# EAGLE design Vale_Project_02 (EAGLE 9.6.2)
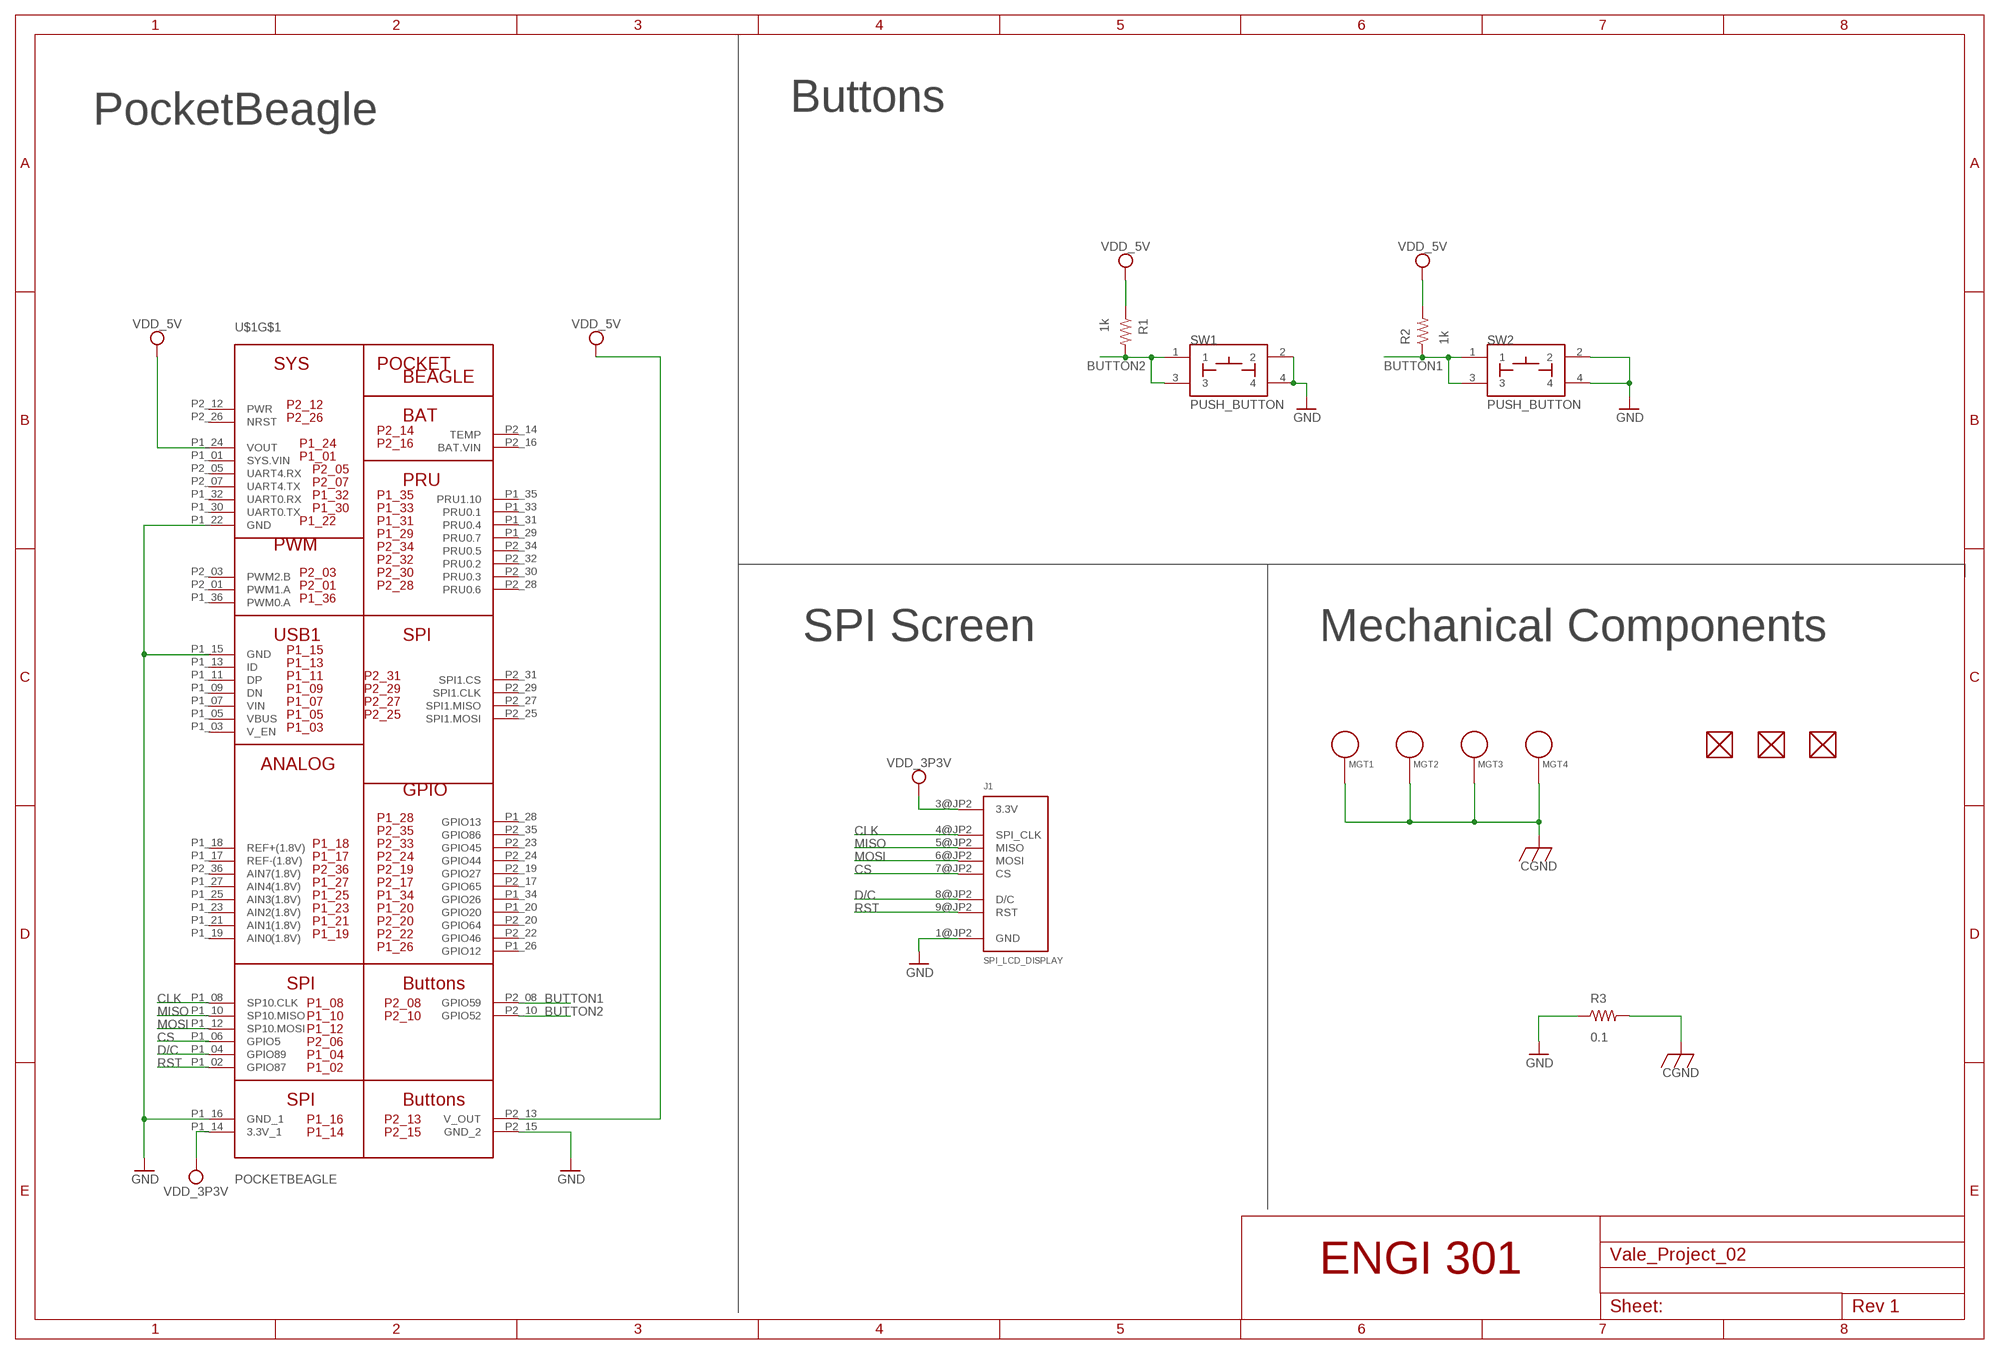
[diagram p0: schematic, sheet 1]

## Parts
FUD1  FIDUCIAL  [FIDUCIAL_40MIL]
FUD2  FIDUCIAL  [FIDUCIAL_40MIL]
FUD3  FIDUCIAL  [FIDUCIAL_40MIL]
J1  SPI_LCD_DISPLAY  [SPI_LCD_DISPLAY]
MGT1  MOUNTING_HOLE  [MOUNTING_HOLE]
MGT2  MOUNTING_HOLE  [MOUNTING_HOLE]
MGT3  MOUNTING_HOLE  [MOUNTING_HOLE]
MGT4  MOUNTING_HOLE  [MOUNTING_HOLE]
R1  1k  R_R1206  [R1206]
R2  1k  R_R1206  [R1206]
R3  0.1  R_R0805  [R0805]
SW1  PUSH_BUTTON  [BUTTON_12.5MM]
SW2  PUSH_BUTTON  [BUTTON_12.5MM]
U$1  POCKETBEAGLE  [POCKETBEAGLE]

## Nets
BUTTON1: R2.1 SW2.1 SW2.3 U$1.P2_08(GPIO59)
BUTTON2: R1.2 SW1.1 SW1.3 U$1.P2_10(GPIO52)
CGND: MGT1.P$1 MGT2.P$1 MGT3.P$1 MGT4.P$1 R3.2
CLK: J1.4@JP2(SPI_CLK) U$1.P1_08(SP10.CLK)
CS: J1.7@JP2(CS) U$1.P1_06(GPIO5)
D/C: J1.8@JP2(D/C) U$1.P1_04(GPIO89)
GND: J1.1@JP2(GND) R3.1 SW1.2 SW1.4 SW2.2 SW2.4 U$1.P1_15(GND) U$1.P1_16(GND_1) U$1.P1_22(GND) U$1.P2_15(GND_2)
MISO: J1.5@JP2(MISO) U$1.P1_10(SP10.MISO)
MOSI: J1.6@JP2(MOSI) U$1.P1_12(SP10.MOSI)
RST: J1.9@JP2(RST) U$1.P1_02(GPIO87)
VDD_3P3V: J1.3@JP2(3.3V) U$1.P1_14(3.3V_1)
VDD_5V: R1.1 R2.2 U$1.P1_24(VOUT) U$1.P2_13(V_OUT)
Unconnected: FUD1.P$1 FUD2.P$1 FUD3.P$1 U$1.P1_01(SYS.VIN) U$1.P1_03(V_EN) U$1.P1_05(VBUS) U$1.P1_07(VIN) U$1.P1_09(DN) U$1.P1_11(DP) U$1.P1_13(ID) U$1.P1_17(REF-(1.8V)) U$1.P1_18(REF+(1.8V)) U$1.P1_19(AIN0(1.8V)) U$1.P1_20(GPIO20) U$1.P1_21(AIN1(1.8V)) U$1.P1_23(AIN2(1.8V)) U$1.P1_25(AIN3(1.8V)) U$1.P1_26(GPIO12) U$1.P1_27(AIN4(1.8V)) U$1.P1_28(GPIO13) U$1.P1_29(PRU0.7) U$1.P1_30(UART0.TX) U$1.P1_31(PRU0.4) U$1.P1_32(UART0.RX) U$1.P1_33(PRU0.1) U$1.P1_34(GPIO26) U$1.P1_35(PRU1.10) U$1.P1_36(PWM0.A) U$1.P2_01(PWM1.A) U$1.P2_03(PWM2.B) U$1.P2_05(UART4.RX) U$1.P2_07(UART4.TX) U$1.P2_12(PWR) U$1.P2_14(TEMP) U$1.P2_16(BAT.VIN) U$1.P2_17(GPIO65) U$1.P2_19(GPIO27) U$1.P2_20(GPIO64) U$1.P2_22(GPIO46) U$1.P2_23(GPIO45) U$1.P2_24(GPIO44) U$1.P2_25(SPI1.MOSI) U$1.P2_26(NRST) U$1.P2_27(SPI1.MISO) U$1.P2_28(PRU0.6) U$1.P2_29(SPI1.CLK) U$1.P2_30(PRU0.3) U$1.P2_31(SPI1.CS) U$1.P2_32(PRU0.2) U$1.P2_34(PRU0.5) U$1.P2_35(GPIO86) U$1.P2_36(AIN7(1.8V))

## Notes on the sheet
- PocketBeagle | Buttons
- SPI Screen | Mechanical Components
- ENGI 301

## Library data of the parts
FUD1-FUD3 = Vale_Project_02:FIDUCIAL
J1 = Vale_Project_02:SPI_LCD_DISPLAY: 2.8" Adafruit SPI Display
MGT1-MGT4 = Vale_Project_02:MOUNTING_HOLE: Chassis Mounting Hole w/GND connection ability
R1-R3 = Vale_Project_02:R_: RESISTOR, American symbol
SW1 SW2 = Vale_Project_02:PUSH_BUTTON
U$1 = Vale_Project_02:POCKETBEAGLE

## Board
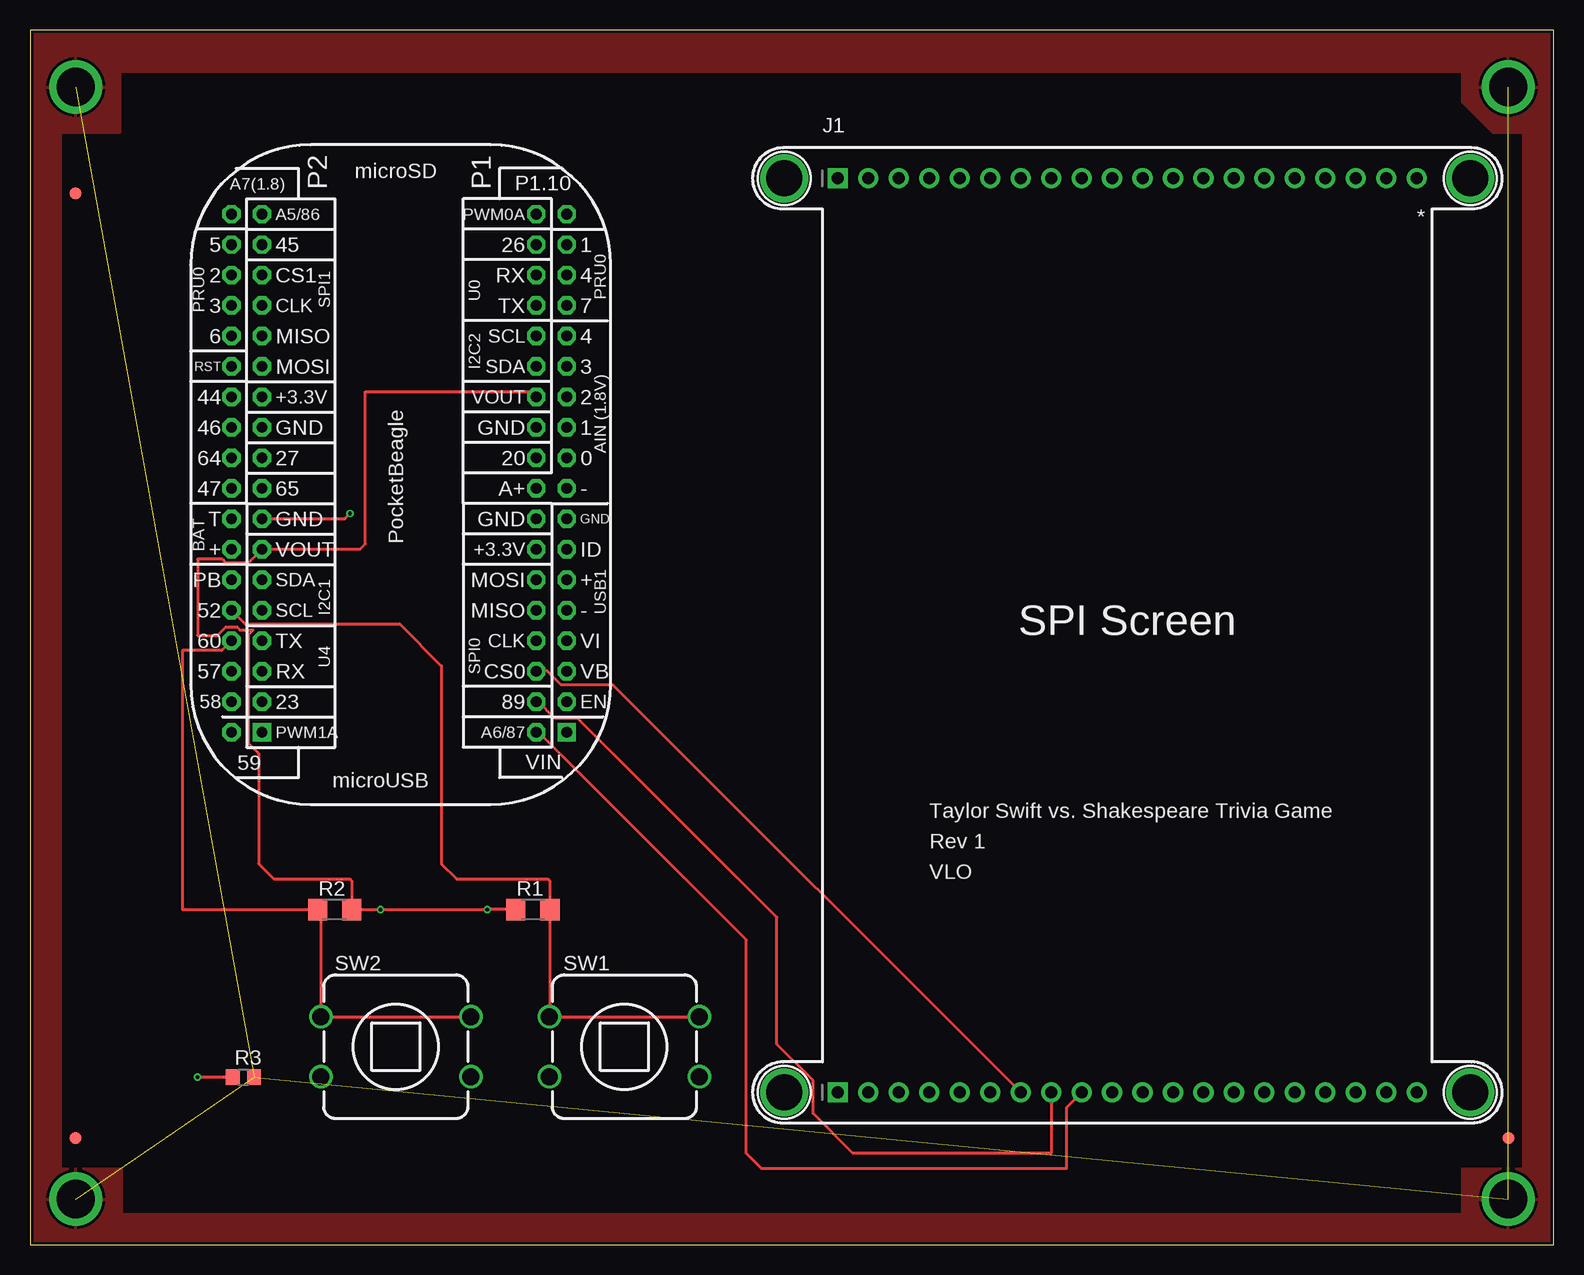
[diagram p1: board, top side]
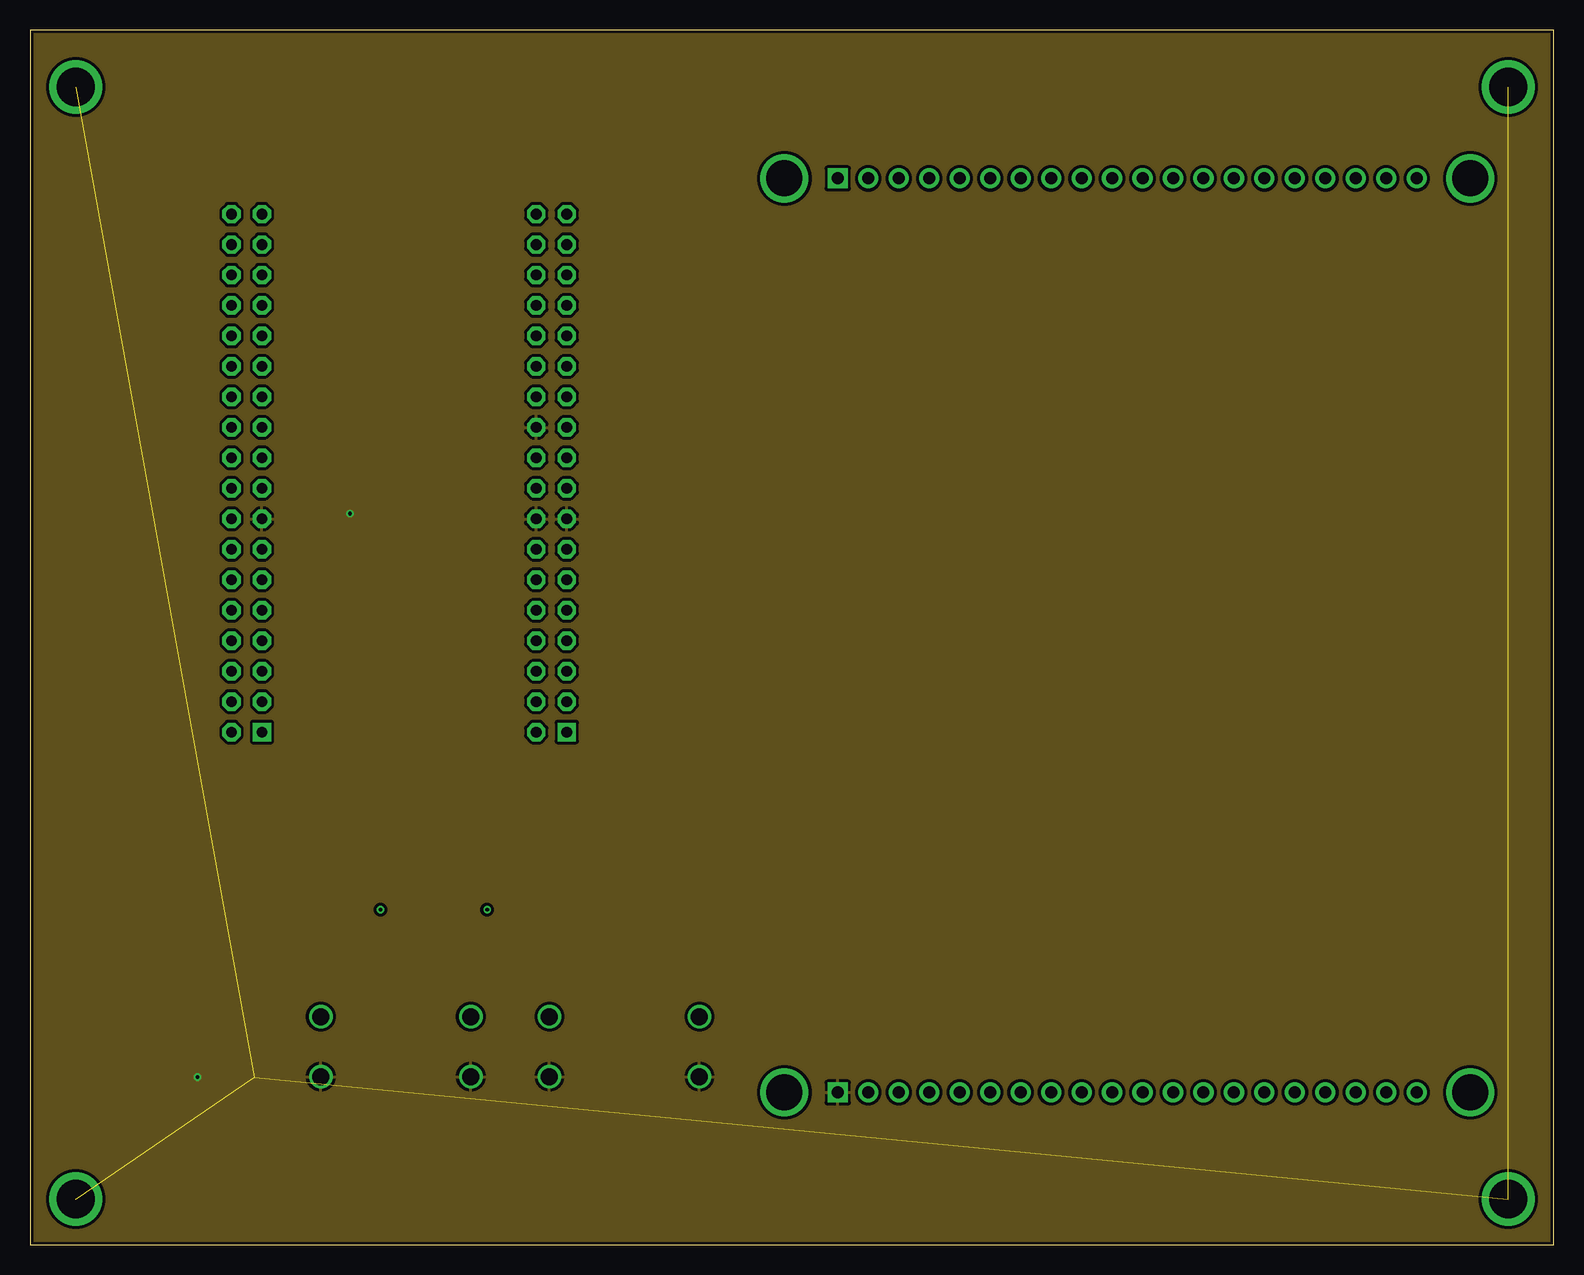
[diagram p2: board, inner layer Route2]
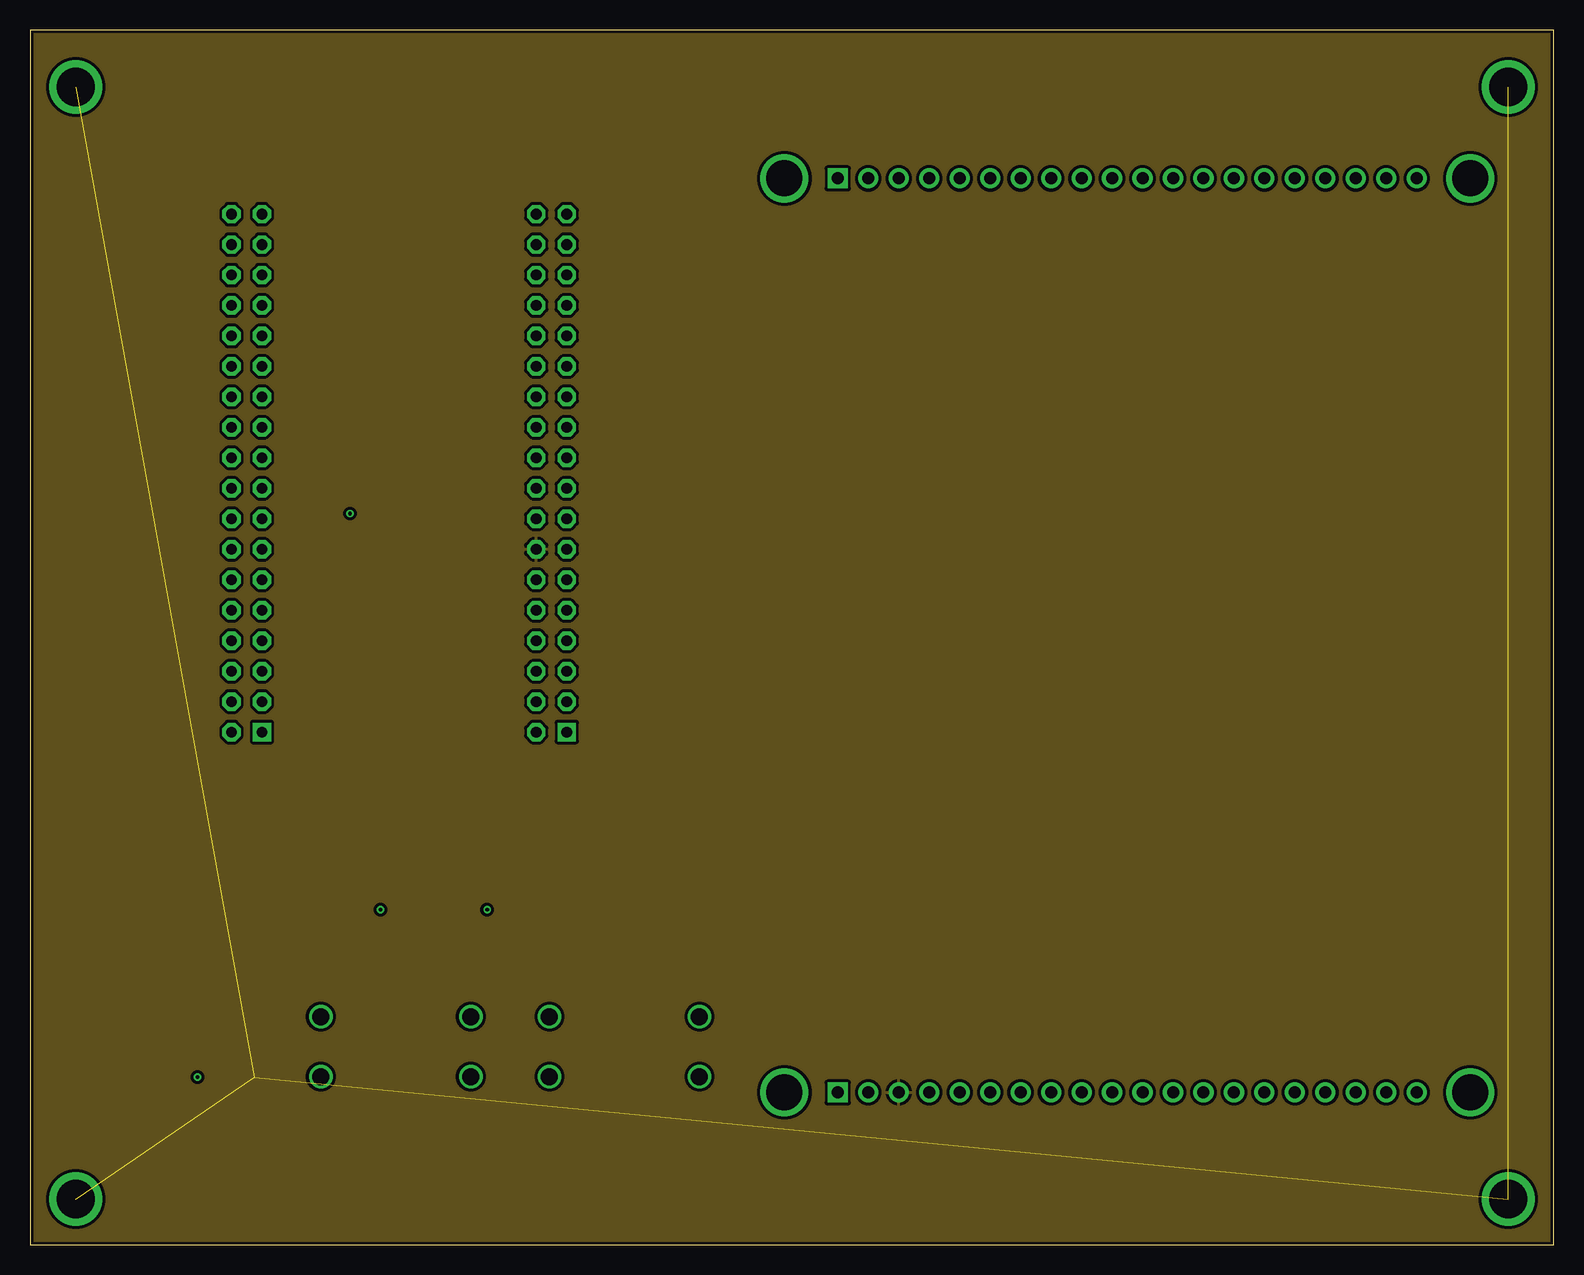
[diagram p3: board, inner layer Route15]
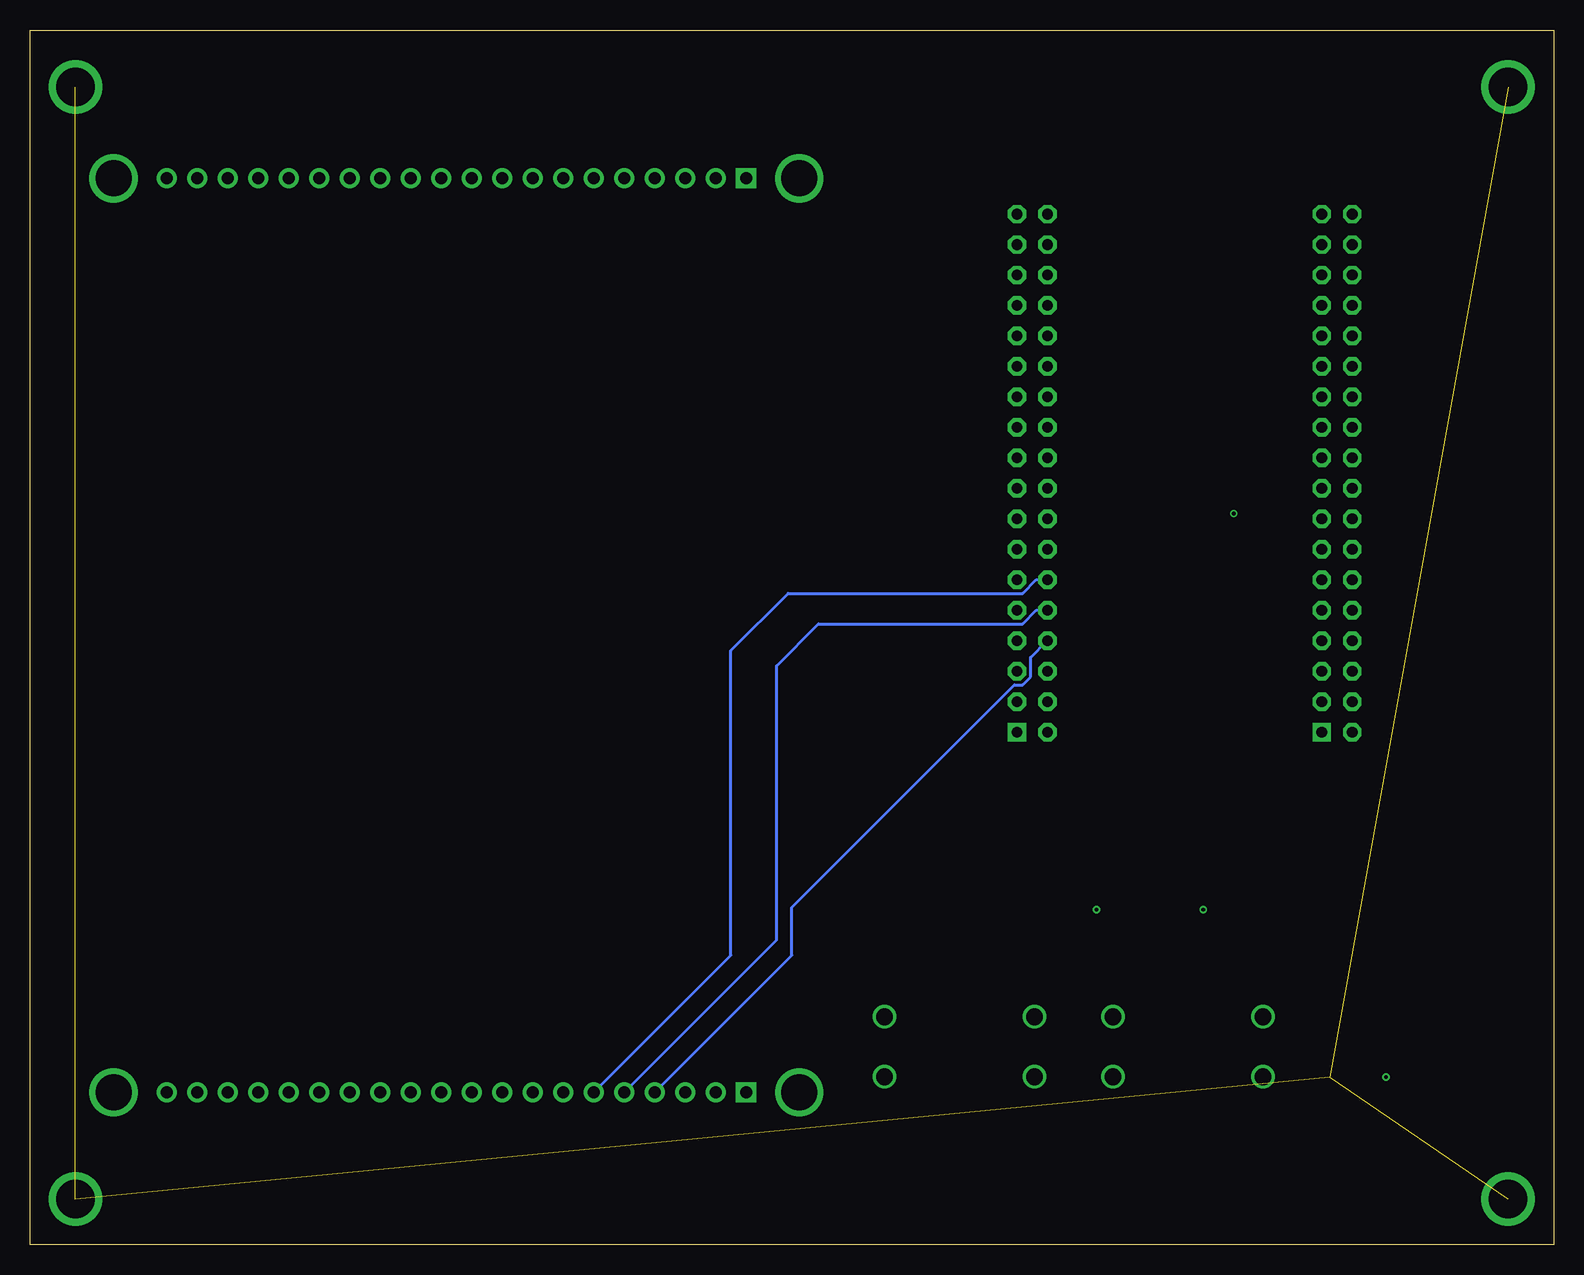
[diagram p4: board, bottom side, seen from below]

Size 126.98 x 101.27 mm. Coordinates in mm from the lower left corner, seen from the top.
Outline: 0,0 126.98,0 126.98,101.27 0,101.27 0,0
Copper layers (1*2*15*16): Top 0.035mm / dielectric 0.23mm / Route2 0.035mm / dielectric 0.93mm / Route15 0.035mm / dielectric 0.23mm / Bottom 0.035mm
Design rules "ENGI301_4lyr": minimum track width 10mil, minimum drill 12mil, track to track 10mil, track to pad 10mil, pad to pad 10mil, via to via 10mil, smd to smd 10mil, copper to edge 10mil, drill to drill 12mil, minimum pad ring 6mil, minimum via ring 6mil, stop-mask expansion 3mil, vias tented up to drill 25mil, thermal gap 10mil

### Footprints (pad centres in the part's own frame; a part is rotated, then mirrored left to right if it is on the bottom)
FIDUCIAL_40MIL = smd 1.016 x 1.016: P$1 0,0
SPI_LCD_DISPLAY = drill 1 pad 1.676 square: 1@JP1 -24.13,38.1; 1@JP2 -24.13,-38.1 | drill 1 pad 1.676: 2@JP1 -21.59,38.1; 2@JP2 -21.59,-38.1; 3@JP1 -19.05,38.1; 3@JP2 -19.05,-38.1; 4@JP1 -16.51,38.1; 4@JP2 -16.51,-38.1; 5@JP1 -13.97,38.1; 5@JP2 -13.97,-38.1; 6@JP1 -11.43,38.1; 6@JP2 -11.43,-38.1; 7@JP1 -8.89,38.1; 7@JP2 -8.89,-38.1; 8@JP1 -6.35,38.1; 8@JP2 -6.35,-38.1; 9@JP1 -3.81,38.1; 9@JP2 -3.81,-38.1; 10@JP1 -1.27,38.1; 10@JP2 -1.27,-38.1; 11@JP1 1.27,38.1; 11@JP2 1.27,-38.1; 12@JP1 3.81,38.1; 12@JP2 3.81,-38.1; 13@JP1 6.35,38.1; 13@JP2 6.35,-38.1; 14@JP1 8.89,38.1; 14@JP2 8.89,-38.1; 15@JP1 11.43,38.1; 15@JP2 11.43,-38.1; 16@JP1 13.97,38.1; 16@JP2 13.97,-38.1; 17@JP1 16.51,38.1; 17@JP2 16.51,-38.1; 18@JP1 19.05,38.1; 18@JP2 19.05,-38.1; 19@JP1 21.59,38.1; 19@JP2 21.59,-38.1; 20@JP1 24.13,38.1; 20@JP2 24.13,-38.1 | drill 3 pad 3.6: P$1@U$7 -28.575,-38.1; P$1@U$15 28.575,-38.1; P$1@U$16 -28.575,38.1; P$1@U$17 28.575,38.1
MOUNTING_HOLE = drill 3.175 pad 4.445: P$1 0,0
R1206 = smd 1.6 x 1.803: 1 -1.422,0; 2 1.422,0
R0805 = smd 1.143 x 1.27: 1 -0.889,0; 2 0.889,0
BUTTON_12.5MM = drill 1.4: 1 -6.25,2.5; 2 -6.25,-2.5; 3 6.25,2.5; 4 6.25,-2.5
POCKETBEAGLE = drill 0.889 pad 1.524 square: P1_01 5.91,3.53; P2_01 5.91,28.93 | drill 0.889 pad 1.524 octagon: P1_02 5.91,6.07; P1_03 8.45,3.53; P1_04 8.45,6.07; P1_05 10.99,3.53; P1_06 10.99,6.07; P1_07 13.53,3.53; P1_08 13.53,6.07; P1_09 16.07,3.53; P1_10 16.07,6.07; P1_11 18.61,3.53; P1_12 18.61,6.07; P1_13 21.15,3.53; P1_14 21.15,6.07; P1_15 23.69,3.53; P1_16 23.69,6.07; P1_17 26.23,3.53; P1_18 26.23,6.07; P1_19 28.77,3.53; P1_20 28.77,6.07; P1_21 31.31,3.53; P1_22 31.31,6.07; P1_23 33.85,3.53; P1_24 33.85,6.07; P1_25 36.39,3.53; P1_26 36.39,6.07; P1_27 38.93,3.53; P1_28 38.93,6.07; P1_29 41.47,3.53; P1_30 41.47,6.07; P1_31 44.01,3.53; P1_32 44.01,6.07; P1_33 46.55,3.53; P1_34 46.55,6.07; P1_35 49.09,3.53; P1_36 49.09,6.07; P2_02 5.91,31.47; P2_03 8.45,28.93; P2_04 8.45,31.47; P2_05 10.99,28.93; P2_06 10.99,31.47; P2_07 13.53,28.93; P2_08 13.53,31.47; P2_09 16.07,28.93; P2_10 16.07,31.47; P2_11 18.61,28.93; P2_12 18.61,31.47; P2_13 21.15,28.93; P2_14 21.15,31.47; P2_15 23.69,28.93; P2_16 23.69,31.47; P2_17 26.23,28.93; P2_18 26.23,31.47; P2_19 28.77,28.93; P2_20 28.77,31.47; P2_21 31.31,28.93; P2_22 31.31,31.47; P2_23 33.85,28.93; P2_24 33.85,31.47; P2_25 36.39,28.93; P2_26 36.39,31.47; P2_27 38.93,28.93; P2_28 38.93,31.47; P2_29 41.47,28.93; P2_30 41.47,31.47; P2_31 44.01,28.93; P2_32 44.01,31.47; P2_33 46.55,28.93; P2_34 46.55,31.47; P2_35 49.09,28.93; P2_36 49.09,31.47

### Placement (x,y rotation side)
FUD1  3.81,87.63 0 top
FUD2  123.19,8.89 0 top
FUD3  3.81,8.89 0 top
J1  91.44,50.8 0 top
MGT1  3.81,3.81 0 top
MGT2  3.81,96.52 0 top
MGT3  123.19,96.52 0 top
MGT4  123.19,3.81 0 top
R1  41.91,27.94 0 top
R2  25.4,27.94 0 top
R3  17.78,13.97 0 top
SW1  49.53,16.51 0 top
SW2  30.48,16.51 0 top
U$1  48.26,36.83 90 top

### Tracks (layer width: path | path; a pad name or v marks a point on that pad's centre or on a via)
BUTTON1
  Top 0.254: U$1.P2_08 15.96,49.53 12.7,49.53 12.7,27.94 R2.1 24.23,27.69 SW2.1 SW2.3
BUTTON2
  Top 0.254: U$1.P2_10 17.93,51.76 30.79,51.76 34.29,48.26 34.29,31.75 35.56,30.48 43.18,30.48 43.33,30.33 R1.2 43.33,19.06 SW1.1 SW1.3
CGND  (4 unrouted)
  pour Top: -2.54,1.27 -2.54,24.13 2.54,24.13 2.54,6.35 7.62,6.35 7.62,2.54 119.38,2.54 119.38,6.35 124.46,6.35 124.46,24.13 129.54,24.13 129.54,-1.27 0,-1.27
  pour Top: -2.54,24.13 -2.54,99.06 1.27,102.87 125.73,102.87 128.27,100.33 128.27,25.4 129.54,24.13 124.46,24.13 124.46,92.71 121.92,92.71 119.38,95.25 119.38,97.79 7.48,97.79 7.48,92.71 2.54,92.71 2.54,24.13
CLK
  Bottom 0.254: J1.4@JP2 63.5,24.13 63.5,28.13 44.95,46.68 44.26,46.68 43.59,47.35 43.59,48.96 U$1.P1_08
CS
  Top 0.254: U$1.P1_06 43.11,47.82 44.26,46.68 48.57,46.68 J1.7@JP2
D/C
  Top 0.254: J1.8@JP2 85.09,7.62 68.58,7.62 65.25,10.95 65.25,13.69 62.23,16.71 62.23,27.3 45.65,43.88 43.75,43.88 42.35,45.28 U$1.P1_04
GND  (via drill 0.3 pad 0.61)
  Top 0.254: R3.1 v13.97,13.97 | U$1.P2_15 26.23,60.52 v26.67,60.96
  pour Route2: -3.81,0 -3.81,100.33 0,104.14 130.81,102.87 130.81,102.87 130.81,-2.74 -1.07,-2.74
MISO
  Bottom 0.254: J1.5@JP2 64.77,25.4 64.77,48.26 61.27,51.76 44.26,51.76 43.11,52.9 U$1.P1_10
MOSI
  Bottom 0.254: J1.6@JP2 68.58,24.13 68.58,49.53 63.81,54.3 44.26,54.3 43.11,55.44 U$1.P1_12
RST
  Top 0.254: J1.9@JP2 86.36,11.43 86.36,6.35 60.96,6.35 59.69,7.62 59.69,25.4 42.35,42.74 U$1.P1_02
VDD_3P3V
  pour Route15: -7.62,-1.27 -7.62,101.6 -1.27,107.95 130.81,107.95 134.62,104.14 134.62,-6.35 -2.54,-6.35
VDD_5V  (via drill 0.3 pad 0.61)
  Top 0.254: U$1.P1_24 41.75,71.12 27.94,71.12 27.94,58.42 27.5,57.98 U$1.P2_13 18.19,56.84 16.32,56.84 16,57.15 13.97,57.15 13.97,50.8 15.61,50.8 16.32,51.5 17.26,51.5 17.52,51.25 18.6,51.25 18.19,50.83 18.19,41.82 19.05,40.96 19.05,31.75 20.32,30.48 26.67,30.48 26.82,30.33 R2.2 v29.21,27.94 v38.1,27.94 R1.1

### Text on the board
tNames: Taylor Swift vs. Shakespeare Trivia Game | Rev 1 | VLO